# Altium schematic sheet powersupply.SchDoc
size A; SheetNumber: 3; SheetTotal: 3
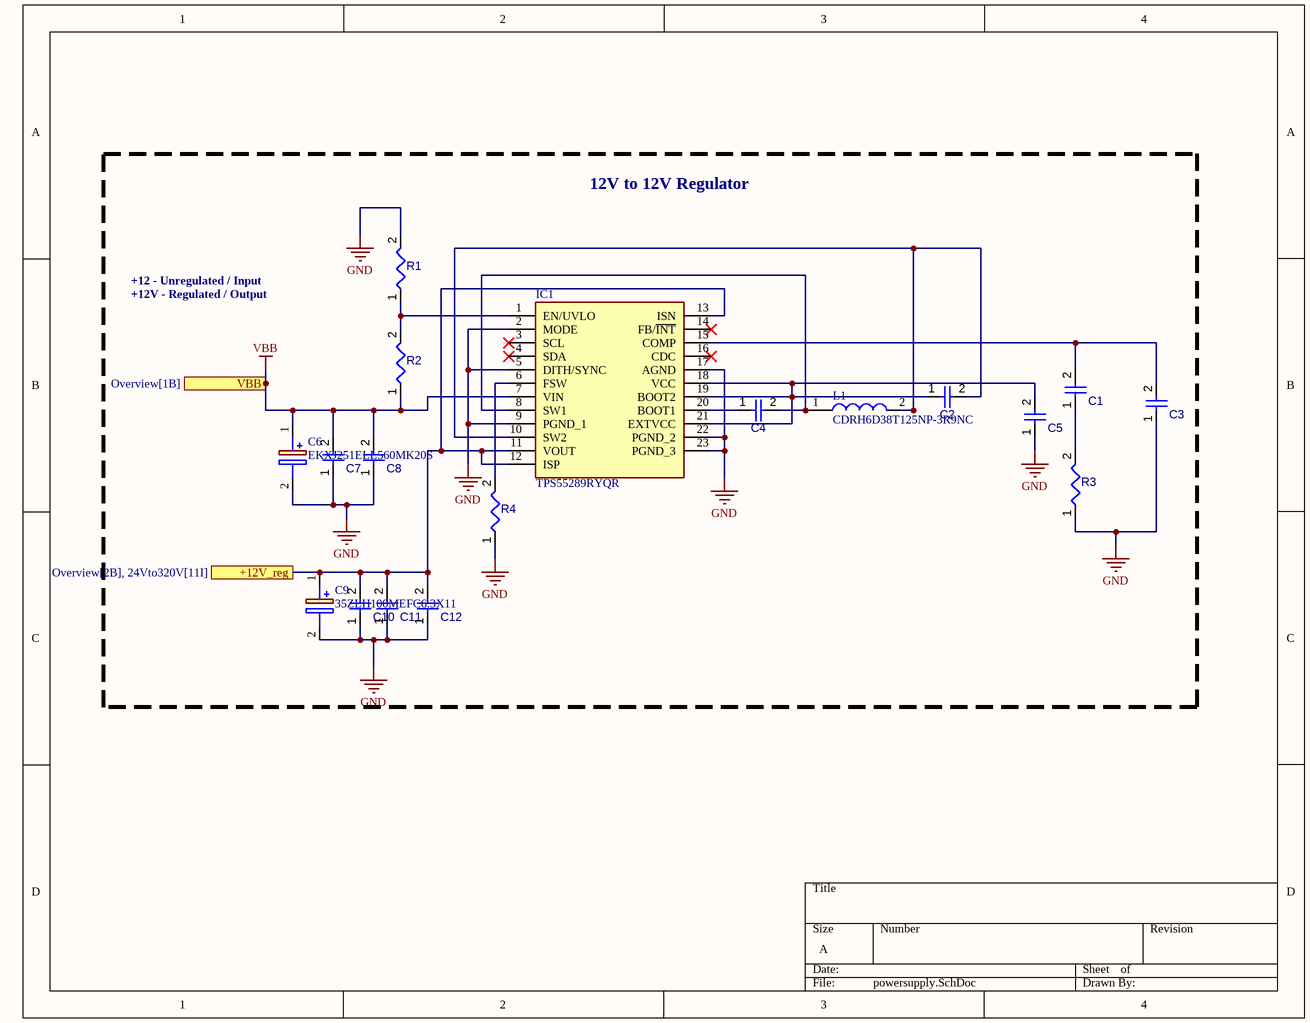
[diagram p0: powersupply.SchDoc]

## Parts
C1  Capacitor 1nF +/-20% 50V 0402  [CAPC0402(1005)33_L]  (value not drawn)
C2  Capacitor 100 nF +/-10% 50 V 0603  [CAPC1608X90X40NL10T20]  (value not drawn)
C3  Capacitor 1 uF +/- 10% 25 V 0805  [CAPC2013X145X50ML20T25]  (value not drawn)
C4  Capacitor 100 nF +/-10% 50 V 0603  [CAPC1608X90X40NL10T20]  (value not drawn)
C5  Capacitor 4.7µF +/-40% 25V 0805  [CAPC0805(2012)145_L]  (value not drawn)
C6  EKXJ251ELL560MK20S  [CAPPRD500W60D1275H2000]
C7  Capacitor 22µF +/-40% 16V 0805  [CAPC0805(2012)145_L]  (value not drawn)
C8  Capacitor 1µF +/-40% 50V 0603  [CAPC0603(1608)100_L]  (value not drawn)
C9  35ZLH100MEFC6.3X11  [CAPPRD250W50D680H1250]
C10  Capacitor 22µF +/-40% 16V 0805  [CAPC0805(2012)145_L]  (value not drawn)
C11  Capacitor 22µF +/-40% 16V 0805  [CAPC0805(2012)145_L]  (value not drawn)
C12  Capacitor 1µF +/-40% 50V 0603  [CAPC0603(1608)100_L]  (value not drawn)
IC1  TPS55289RYQR  [TPS55289RYQR]
L1  CDRH6D38T125NP-3R9NC  [CDRH6D18HPNP101PC]
R1  Resistor 100k +/-1% 1206 250 mW  [RESC3216X60X45ML15T20]  (value not drawn)
R2  Resistor 100k +/-1% 0603 100 mW  [RESC1608X55X25ML10T15]  (value not drawn)
R3  Resistor 100k +/-1% 0603 100 mW  [RESC1608X55X25ML10T15]  (value not drawn)
R4  Resistor 100k +/-1% 1206 250 mW  [RESC3216X60X45ML15T20]  (value not drawn)

## Ports
+12V_reg (see Overview[2B], 24Vto320V[11I]), VBB (see Overview[1B])

## Nets
GND: C3.1 C5.1 C6.2(-) C7.1 C8.1 C9.2(-) C10.1 C11.1 C12.1 IC1.2(MODE) IC1.5(DITH/SYNC) IC1.9(PGND_1) IC1.17(AGND) IC1.22(PGND_2) IC1.23(PGND_3) R1.2 R3.1 R4.1
VBB: C6.1(+) C7.2 C8.2 IC1.7(VIN) R2.1 ; port VBB
+12V_reg: C9.1(+) C10.2 C11.2 C12.2 IC1.11(VOUT) IC1.12(ISP) IC1.13(ISN) ; port +12V_reg
NetC1_1: C1.1 R3.2
NetC1_2: C1.2 C3.2 IC1.15(COMP)
NetC2_1: C2.1 C5.2 IC1.18(VCC) IC1.19(BOOT2) IC1.21(EXTVCC)
NetC2_2: C2.2 IC1.10(SW2) L1.2
NetC4_1: C4.1 IC1.20(BOOT1)
NetC4_2: C4.2 IC1.8(SW1) L1.1
NetIC1_1: IC1.1(EN/UVLO) R1.1 R2.2
NetIC1_6: IC1.6(FSW) R4.2

Not connected (* = marked no-connect by the designer): IC1 3(SCL)* 4(SDA)* 14(FB/~{INT})* 16(CDC)*

## Notes on the sheet
- 12V to 12V Regulator
- +12 - Unregulated / Input
- +12V - Regulated / Output

## Library data of the parts
C1 = CMP-001-00066-3: Chip Capacitor, 1nF +/-20%, 50V, 0402, Thickness 0.33 mm; Tolerance: 10%; Mounting Technology: SMT; Case/Package: 0402; Pins: 2; Min Operating Temperature: -55°C; Max Operating Temperature: 85°C; Voltage Rating: 50V; Value: 1nF
C2 C4 = CMP-001-00017-6: Chip Capacitor, 100 nF, +/- 10%, 50 V, 0603 (1608 Metric); Capacitor Type: Ceramic; Voltage Rating: 50V; Value: 100nF; Mounting Technology: SM; Case/Package: 0603; Pins: 2; RoHS Compliant: True; Min Operating Temperature: -55°C; Max Operating Temperature: 125°C; Tolerance: 10%
C3 = CMP-001-00010-6: Chip Capacitor, 5.1pF, +/-10%, 250 V, 0805 (2012 Metric); Capacitor Type: Ceramic; Voltage Rating: 25V; Value: 1µF; Mounting Technology: SM; Case/Package: 0805; Pins: 2; RoHS Compliant: True; Min Operating Temperature: -55°C; Max Operating Temperature: 125°C; Tolerance: 10%
C5 = CMP-001-00080-4: Chip Capacitor, 4.7µF +/-40%, 25V, 0805, Thickness 1.45 mm; Tolerance: 20%; Mounting Technology: SMT; Case/Package: 0805; Pins: 2; Min Operating Temperature: -55°C; Max Operating Temperature: 85°C; Voltage Rating: 25V; Value: 4.7µF
C6 = UPW0J222MHD: 56uF 250V Aluminum Electrolytic Capacitors Through Hole,D12.5xL20mm 10000hrs@105℃; Manufacturer_Name: Nichicon; Datasheet Link: https://componentsearchengine.com/Datasheets/1/UPW0J222MHD.pdf; Height: 20mm; Manufacturer_Part_Number: UPW0J222MHD; Mouser Part Number: 647-UPW0J222MHD; Mouser Price/Stock: https://www.mouser.co.uk/ProductDetail/Nichicon/UPW0J222MHD?qs=xKlMw8j03VdQkAIq%2FPYnUg%3D%3D
C7 C10 C11 = CMP-001-00081-4: Chip Capacitor, 22µF +/-20%, 25V, 0805, Thickness 1.45 mm X5R; Tolerance: 5%; Mounting Technology: SMT; Case/Package: 0805; Pins: 2; Min Operating Temperature: -55°C; Max Operating Temperature: 85°C; Voltage Rating: 16V; Value: 22µF
C8 C12 = CMP-001-00078-4: Chip Capacitor, 1µF +/-40%, 50V, 0603, Thickness 1 mm; Tolerance: 10%; Mounting Technology: SMT; Case/Package: 0603; Pins: 2; Min Operating Temperature: -55°C; Max Operating Temperature: 85°C; Voltage Rating: 50V; Value: 1µF
C9 = MAL203856101E3: 100uF 35V Aluminum Electrolytic Capacitors Through Hole,D6.3xL11mm 6000hrs@105℃; Manufacturer_Name: Vishay; Datasheet Link: https://componentsearchengine.com/Datasheets/2/MAL203856101E3.pdf; Height: 12.5mm; Manufacturer_Part_Number: MAL203856101E3; Mouser Part Number: 594-MAL203856101E3; Mouser Price/Stock: https://www.mouser.co.uk/ProductDetail/Vishay-BC-Components/MAL203856101E3?qs=G99oyVYclWUG3wiHKtPKfA%3D%3D; Arrow Part Number: MAL203856101E3; Arrow Price/Stock: https://www.arrow.com/en/products/mal203856101e3/vishay
IC1 = TPS55289RYQR: Integrated Circuit; Manufacturer_Name: Texas Instruments; Datasheet Link: https://www.ti.com/lit/ds/symlink/tps55289.pdf?ts=1664818706180&ref_url=https%253A%252F%252Fwww.ti.com%252Fproduct%252FTPS55289%252Fpart-details%252FTPS55289RYQR%253FkeyMatch%253DTPS55289RYQR; Height: 1mm; Manufacturer_Part_Number: TPS55289RYQR; Mouser Part Number: 595-TPS55289RYQR; Mouser Price/Stock: https://www.mouser.co.uk/ProductDetail/Texas-Instruments/TPS55289RYQR?qs=T%252BzbugeAwjhgaIN94Lbpjg%3D%3D; Arrow Part Number: TPS55289RYQR; Arrow Price/Stock: https://www.arrow.com/en/products/tps55289ryqr/texas-instruments.html?utm_currency=USD&region=nac
L1 = CDRH6D18HPNP-101PC: Inductor 3.9uH ,19.6mOhm, SMD, 6.7mm X 6.7mm; Manufacturer_Name: Sumida; Datasheet Link: https://4donline.ihs.com/images/VipMasterIC/IC/SMDC/SMDC-S-A0002849326/SMDC-S-A0002849326-1.pdf?hkey=EF798316E3902B6ED9A73243A3159BB0; Height: 2mm; Manufacturer_Part_Number: CDRH6D18HPNP-101PC
R1 = CMP-009-00025-5: Chip Resistor, 100 KOhm, +/- 1%, 0.25 W, -55 to 155 degC, 1206 (3216 Metric); Power: 250mW; Voltage Rating: 200V; Mounting Technology: SM; Case/Package: 1206; Pins: 2; RoHS Compliant: True; Min Operating Temperature: -55°C; Max Operating Temperature: 155°C; Tolerance: 1%; Value: 100k
R2 = CMP-009-00023-5: Chip Resistor, 715 KOhm, +/- 1%, 0.1 W, -55 to 155 degC, 0603 (1608 Metric); Power: 100mW; Voltage Rating: 50V; Mounting Technology: SM; Case/Package: 0603; Pins: 2; RoHS Compliant: True; Min Operating Temperature: -55°C; Max Operating Temperature: 155°C; Tolerance: 1%; Value: 100k
R3 = CMP-009-00023-5: Chip Resistor, 105 KOhm, +/- 1%, 0.1 W, -55 to 155 degC, 0603 (1608 Metric); Power: 100mW; Voltage Rating: 50V; Mounting Technology: SM; Case/Package: 0603; Pins: 2; RoHS Compliant: True; Min Operating Temperature: -55°C; Max Operating Temperature: 155°C; Tolerance: 1%; Value: 100k
R4 = CMP-009-00025-5: Chip Resistor, 48.7 KOhm, +/- 1%, 0.25 W, -55 to 155 degC, 200V, 1206 (3216 Metric); Power: 250mW; Mounting Technology: SM; Case/Package: 1206; Pins: 2; RoHS Compliant: True; Min Operating Temperature: -55°C; Max Operating Temperature: 155°C; Tolerance: 1%; Voltage Rating: 200V; Value: 100k